# EAGLE design 2020can_master_v5 (EAGLE 9.6.2)
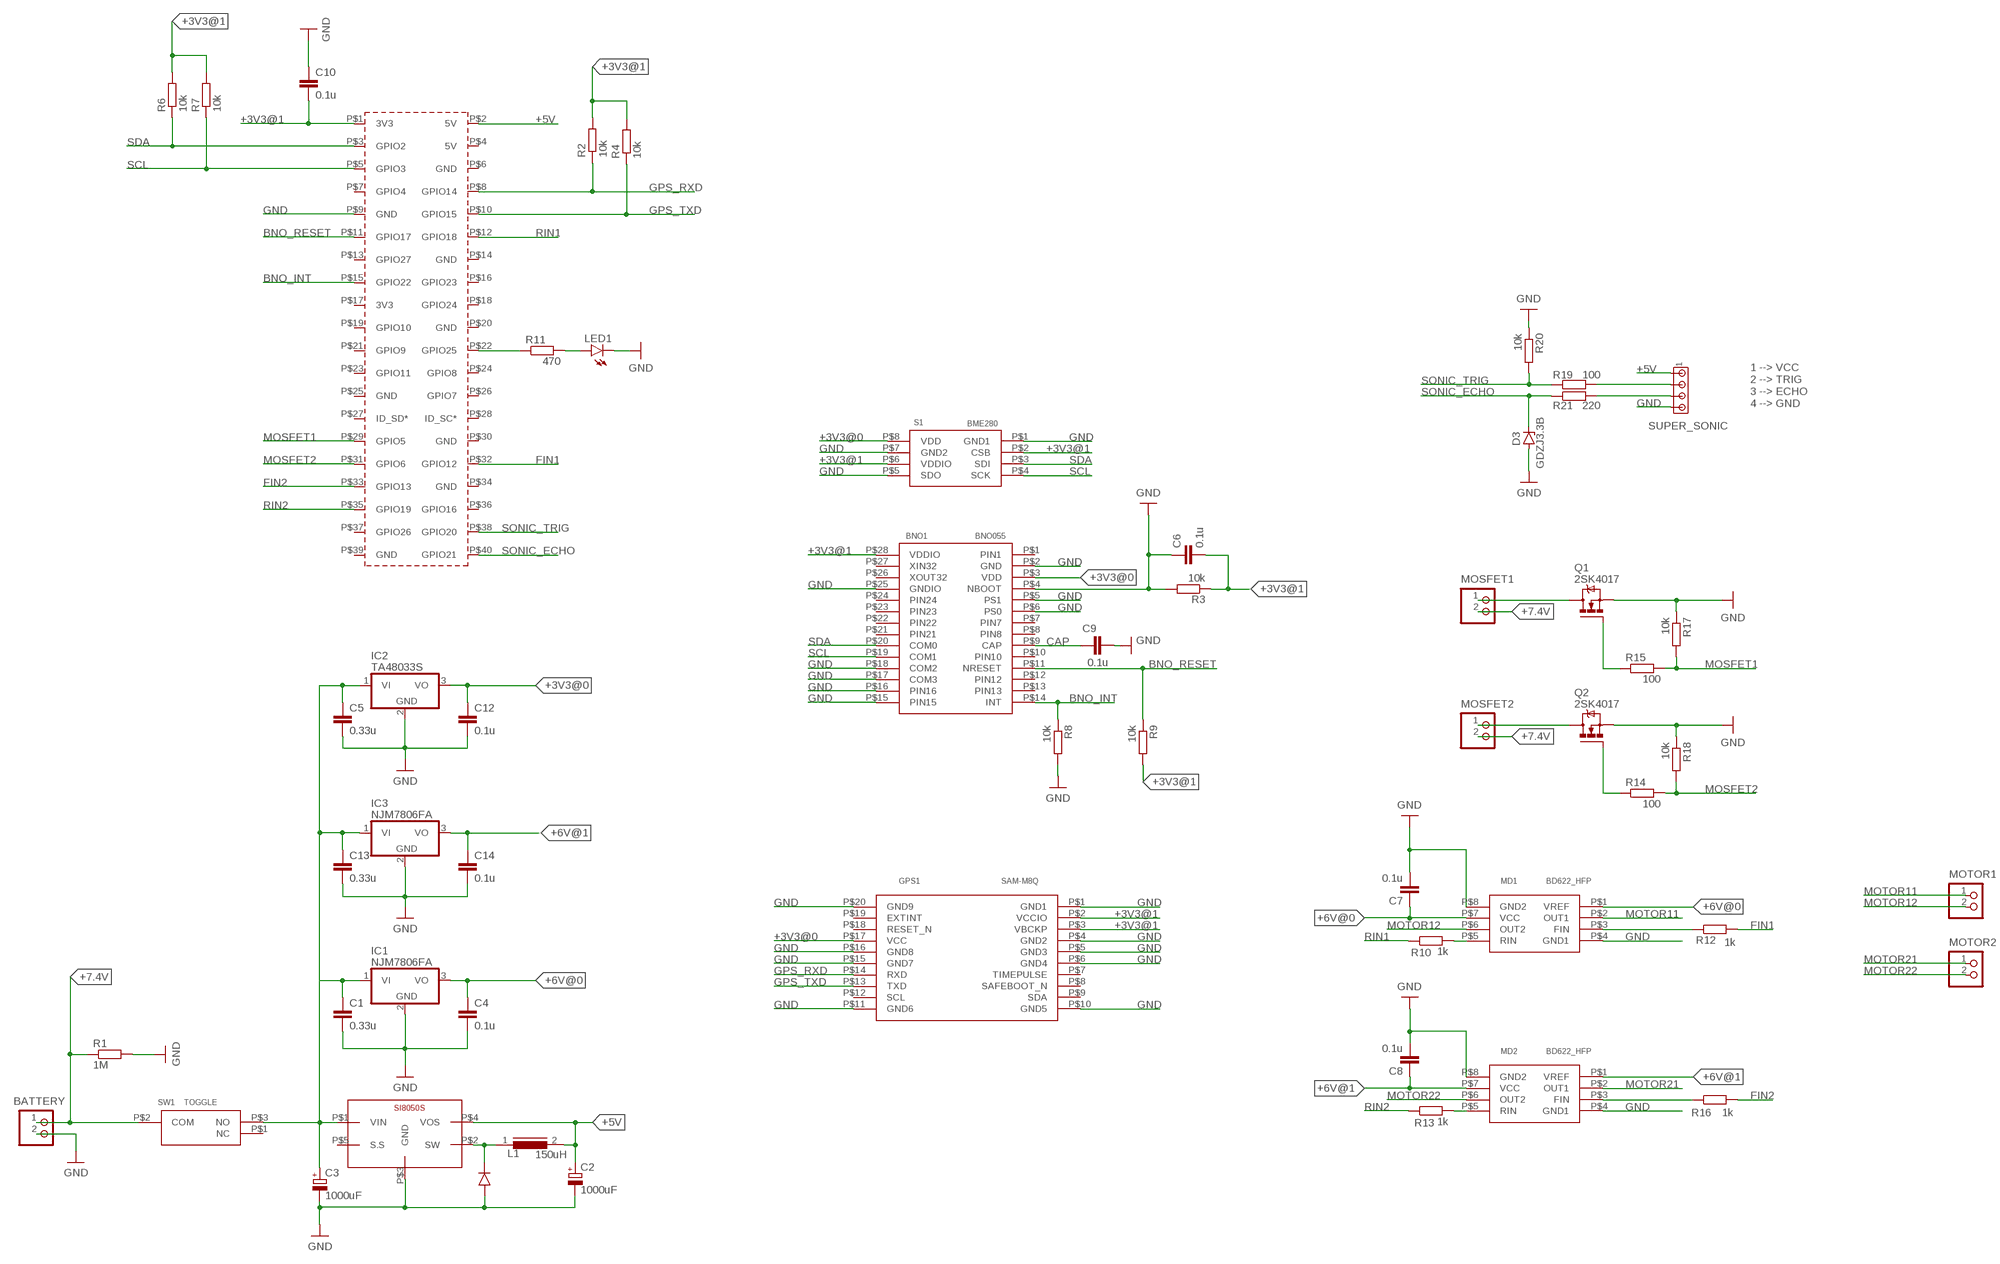
[diagram p0: schematic, sheet 1]

## Parts
BATTERY  B2P-VH  [B2P-VH]
BNO1  BNO055  [BNO055]
C1  0.33u  C5/3  [C5B3]
C2  1000uF  CPOL-EUE5-10.5  [E5-10,5]
C3  1000uF  CPOL-EUE5-10.5  [E5-10,5]
C4  0.1u  C5/3  [C5B3]
C5  0.33u  C5/3  [C5B3]
C6  0.1u  C-EUC1206  [C1206]
C7  0.1u  C-EUC1206  [C1206]
C8  0.1u  C-EUC1206  [C1206]
C9  0.1u  C-EUC1206  [C1206]
C10  0.1u  C-EUC1206  [C1206]
C12  0.1u  C5/3  [C5B3]
C13  0.33u  C5/3  [C5B3]
C14  0.1u  C5/3  [C5B3]
D3  GDZJ3.3B  1N821  [DO35Z10]
DIODE_1.1  DIODE_1.5  [DIODE_1.5]
GPS1  SAM-M8Q  [SAM-M8Q]
IC1  NJM7806FA  786TV  [TO220V]
IC2  TA48033S  786TV  [TO220V]
IC3  NJM7806FA  786TV  [TO220V]
L1  150uH  SFT830D  [SFT830D]
LED1  LED5MM  [LED5MM]
MD1  BD622_HFP  [BD62**_HRP7]
MD2  BD622_HFP  [BD62**_HRP7]
MOSFET1  B2P-VH  [B2P-VH]
MOSFET2  B2P-VH  [B2P-VH]
MOTOR1  B2P-VH  [B2P-VH]
MOTOR2  B2P-VH  [B2P-VH]
PCB1  RPI3RPI3  [RPI3]
Q1  2SK4017  IRF520  [TO220BV]
Q2  2SK4017  IRF520  [TO220BV]
R1  1M  R-EU_R2012  [R2012]
R2  10k  R-EU_R2012  [R2012]
R3  10k  R-EU_R2012  [R2012]
R4  10k  R-EU_R2012  [R2012]
R6  10k  R-EU_R2012  [R2012]
R7  10k  R-EU_R2012  [R2012]
R8  10k  R-EU_R2012  [R2012]
R9  10k  R-EU_R2012  [R2012]
R10  1k  R-EU_R2012  [R2012]
R11  470  R-EU_0207/10  [0207/10]
R12  1k  R-EU_R2012  [R2012]
R13  1k  R-EU_R2012  [R2012]
R14  100  R-EU_0207/10  [0207/10]
R15  100  R-EU_0207/10  [0207/10]
R16  1k  R-EU_R2012  [R2012]
R17  10k  R-EU_R2012  [R2012]
R18  10k  R-EU_R2012  [R2012]
R19  100  R-EU_0207/10  [0207/10]
R20  10k  R-EU_R2012  [R2012]
R21  220  R-EU_0207/10  [0207/10]
S1  BME280  [BME280]
SI8050S1  SI8050S  [SI8050S]
SUPER_SONIC  MTA04-100  [10X04MTA]
SW1  TOGGLE  TOGGLE_1MS1-T1-B1-M2-Q-N-S  [TOGGLE_1MS1-T1-B1-M2-Q-N-S]

## Nets
+3V3@0 [sensor]: BNO1.P$3(VDD) C12.1 GPS1.P$17(VCC) IC2.3(VO) S1.P$8(VDD)
+3V3@1 [sensor]: BNO1.P$28(VDDIO) C6.2 C10.2 GPS1.P$2(VCCIO) GPS1.P$3(VBCKP) PCB1.P$1(3V3) R2.2 R3.1 R4.2 R6.2 R7.2 R9.2 S1.P$2(CSB) S1.P$6(VDDIO)
+5V [power]: C2.+ L1.2 PCB1.P$2(5V) SI8050S1.P$4(VOS) SUPER_SONIC.1
+6V@0 [motor]: C4.1 C7.1 IC1.3(VO) MD1.P$1(VREF) MD1.P$7(VCC)
+6V@1 [motor]: C8.1 C14.1 IC3.3(VO) MD2.P$1(VREF) MD2.P$7(VCC)
+7.4V [power]: BATTERY.1 MOSFET1.2 MOSFET2.2 R1.1 SW1.P$2(COM)
BNO_INT [signal]: BNO1.P$14(INT) PCB1.P$15(GPIO22) R8.1
BNO_RESET [signal]: BNO1.P$11(NRESET) PCB1.P$11(GPIO17) R9.1
CAP [signal]: BNO1.P$9(CAP) C9.1
FIN1 [signal]: PCB1.P$32(GPIO12) R12.2
FIN2 [signal]: PCB1.P$33(GPIO13) R16.2
GND: BATTERY.2 BNO1.P$2(GND) BNO1.P$4(NBOOT) BNO1.P$5(PS1) BNO1.P$6(PS0) BNO1.P$15(PIN15) BNO1.P$16(PIN16) BNO1.P$17(COM3) BNO1.P$18(COM2) BNO1.P$25(GNDIO) C1.2 C2.- C3.- C4.2 C5.2 C6.1 C7.2 C8.2 C9.2 C10.1 C12.2 D3.A DIODE_1.1.P$1(ANODE) GPS1.P$1(GND1) GPS1.P$4(GND2) GPS1.P$5(GND3) GPS1.P$6(GND4) GPS1.P$10(GND5) GPS1.P$11(GND6) GPS1.P$15(GND7) GPS1.P$16(GND8) GPS1.P$20(GND9) IC1.2(GND) IC2.2(GND) LED1.K(C) MD1.P$4(GND1) MD1.P$8(GND2) MD2.P$4(GND1) MD2.P$8(GND2) PCB1.P$9(GND) Q1.S Q2.S R1.2 R3.2 R8.2 R17.1 R18.1 R20.1 S1.P$1(GND1) S1.P$5(SDO) S1.P$7(GND2) SI8050S1.P$3(GND) SUPER_SONIC.4
GPS_RXD [signal]: GPS1.P$14(RXD) PCB1.P$8(GPIO14) R2.1
GPS_TXD [signal]: GPS1.P$13(TXD) PCB1.P$10(GPIO15) R4.1
MOSFET1 [signal]: PCB1.P$29(GPIO5) R15.2 R17.2
MOSFET2 [signal]: PCB1.P$31(GPIO6) R14.2 R18.2
MOTOR11 [motor]: MD1.P$2(OUT1) MOTOR1.1
MOTOR12 [motor]: MD1.P$6(OUT2) MOTOR1.2
MOTOR21 [motor]: MD2.P$2(OUT1) MOTOR2.1
MOTOR22 [motor]: MD2.P$6(OUT2) MOTOR2.2
N$2 [motor]: DIODE_1.1.P$2(CATHODE) L1.1 SI8050S1.P$2(SW)
N$3 [signal]: PCB1.P$22(GPIO25) R11.1
N$4 [power]: C1.1 C3.+ C5.1 C13.1 IC1.1(VI) IC2.1(VI) IC3.1(VI) SI8050S1.P$1(VIN) SW1.P$3(NO)
N$5: LED1.A R11.2
N$6 [mos]: MOSFET1.1 Q1.D
N$7: MD1.P$3(FIN) R12.1
N$8 [mos]: MOSFET2.1 Q2.D
N$9: MD1.P$5(RIN) R10.2
N$10: Q1.G R15.1
N$11: Q2.G R14.1
N$12: MD2.P$3(FIN) R16.1
N$13: C13.2 C14.2 IC3.2(GND)
N$14: MD2.P$5(RIN) R13.2
N$15: R19.2 SUPER_SONIC.2
N$16: R21.2 SUPER_SONIC.3
RIN1 [signal]: PCB1.P$12(GPIO18) R10.1
RIN2 [signal]: PCB1.P$35(GPIO19) R13.1
SCL [signal]: BNO1.P$19(COM1) PCB1.P$5(GPIO3) R7.1 S1.P$4(SCK)
SDA [signal]: BNO1.P$20(COM0) PCB1.P$3(GPIO2) R6.1 S1.P$3(SDI)
SONIC_ECHO [signal]: D3.C PCB1.P$40(GPIO21) R21.1
SONIC_TRIG [signal]: PCB1.P$38(GPIO20) R19.1 R20.2
Unconnected: BNO1.P$1(PIN1) BNO1.P$7(PIN7) BNO1.P$8(PIN8) BNO1.P$10(PIN10) BNO1.P$12(PIN12) BNO1.P$13(PIN13) BNO1.P$21(PIN21) BNO1.P$22(PIN22) BNO1.P$23(PIN23) BNO1.P$24(PIN24) BNO1.P$26(XOUT32) BNO1.P$27(XIN32) GPS1.P$7(TIMEPULSE) GPS1.P$8(SAFEBOOT_N) GPS1.P$9(SDA) GPS1.P$12(SCL) GPS1.P$18(RESET_N) GPS1.P$19(EXTINT) PCB1.P$4(5V) PCB1.P$6(GND) PCB1.P$7(GPIO4) PCB1.P$13(GPIO27) PCB1.P$14(GND) PCB1.P$16(GPIO23) PCB1.P$17(3V3) PCB1.P$18(GPIO24) PCB1.P$19(GPIO10) PCB1.P$20(GND) PCB1.P$21(GPIO9) PCB1.P$23(GPIO11) PCB1.P$24(GPIO8) PCB1.P$25(GND) PCB1.P$26(GPIO7) PCB1.P$27(ID_SD*) PCB1.P$28(ID_SC*) PCB1.P$30(GND) PCB1.P$34(GND) PCB1.P$36(GPIO16) PCB1.P$37(GPIO26) PCB1.P$39(GND) SI8050S1.P$5(S.S) SW1.P$1(NC)

## Notes on the sheet
- 1 --> VCC
  2 --> TRIG
  3 --> ECHO
  4 --> GND

## Library data of the parts
BATTERY MOSFET1 MOSFET2 MOTOR1 MOTOR2 = CONN_VH:B2P-VH: Wire-to-Board 3.96mm pitch top mount connector Source: http://www.jst-mfg.com/product/pdf/jpn/VH.pdf http://www.jst-mfg.com/product/detail.php?series=262
BNO1 = BNO055:BNO055
C1 C4 C5 C12-C14 = capacitor-wima:C: CAPACITOR naming: grid - package width
C2 C3 = resistor:CPOL-EU: POLARIZED CAPACITOR, European symbol
C6-C10 = rcl:C-EU: CAPACITOR, European symbol; SPICEPREFIX: C
D3 = diode:1N821: Reference DIODE temperature compensated, 6,2 V
DIODE_1.1 = diode_1.5mm:DIODE_1.5
GPS1 = GPS:SAM-M8Q
IC1-IC3 = linear:78*: Positive VOLTAGE REGULATOR Source: http://cache.national.com/ds/LM/LM78L05.pdf http://www.fairchildsemi.com/ds/LM/LM7805.pdf
L1 = inductors:SFT830D: INDUCTOR; SPICEPREFIX: L
LED1 = led:LED: LED OSRAM: - CHIPLED LG R971, LG N971, LY N971, LG Q971, LY Q971, LO R971, LY R971 LH N974, LH R974 LS Q976, LO Q976, LY Q976 LO Q996 - Hyper CHIPLED LW Q18S LB Q993, LB Q99A, LB R99A - SideLED LS A670, LO A670, LY A670, LG A670, LP A670 LB A673, LV A673, LT A673, LW A673 LH A674 LY A675 LS A676, LA A676, LO A676, LY A676, LW A676 LS A679, LY A679, LG A679 - Hyper Micro SIDELED® LS Y876, LA Y876, LO Y876, LY Y876 LT Y87S - SmartLED LW L88C, LW L88S LB L89C, LB L89S, LG L890 LS L89K, LO L89K, LY L89K LS L896, LA L896, LO L896, LY L896 - TOPLED LS T670, LO T670, LY T670, LG T670, LP T670 LSG T670, LSP T670, LSY T670, LOP T670, LYG T670 LG T671, LOG T671, LSG T671 LB T673, LV T673, LT T673, LW T673 LH T674 LS T676, LA T676, LO T676, LY T676, LB T676, LH T676, LSB T676, LW T676 LB T67C, LV T67C, LT T67C, LS T67K, LO T67K, LY T67K, LW E67C LS E67B, LA E67B, LO E67B, LY E67B, LB E67C, LV E67C, LT E67C LW T67C LS T679, LY T679, LG T679 LS T770, LO T770, LY T770, LG T770, LP T770 LB T773, LV T773, LT T773, LW T773 LH T774 LS E675, LA E675, LY E675, LS T675 LS T776, LA T776, LO T776, LY T776, LB T776 LHGB T686 LT T68C, LB T68C - Hyper Mini TOPLED® LB M676 - Mini TOPLED Santana® LG M470 LS M47K, LO M47K, LY M47K Source: http://www.osram.convergy.de LUXEON: - LUMILED® LXK2-PW12-R00, LXK2-PW12-S00, LXK2-PW14-U00, LXK2-PW14-V00 LXK2-PM12-R00, LXK2-PM12-S00, LXK2-PM14-U00 LXK2-PE12-Q00, LXK2-PE12-R00, LXK2-PE12-S00, LXK2-PE14-T00, LXK2-PE14-U00 LXK2-PB12-K00, LXK2-PB12-L00, LXK2-PB12-M00, LXK2-PB14-N00, LXK2-PB14-P00, LXK2-PB14-Q00 LXK2-PR12-L00, LXK2-PR12-M00, LXK2-PR14-Q00, LXK2-PR14-R00 LXK2-PD12-Q00, LXK2-PD12-R00, LXK2-PD12-S00 LXK2-PH12-R00, LXK2-PH12-S00 LXK2-PL12-P00, LXK2-PL12-Q00, LXK2-PL12-R00 Source: www.luxeon.com KINGBRIGHT: KA-3528ASYC Source: www.kingbright.com
MD1 MD2 = BD62_:BD622*_HFP
PCB1 = Raspberry Pi 3 model B:RPI3: Device for Raspberry Pi 3 board created by Dave Young for www.element14.com More information and support community is available at https://www.element14.com/community/community/raspberry-pi Device for Raspberry Pi 3 board updated by Gerald Schwarz for www.element14.com On RPI3 addet the layer milling and created a mirrored shield.
Q1 Q2 = transistor-power:IRF520: HEXFET Power MOSFET
R1-R4 R6-R21 = rcl:R-EU_: RESISTOR, European symbol; SPICEPREFIX: R
S1 = BME280:BME280
SI8050S1 = SI-8050S:SI8050S
SUPER_SONIC = con-amp:MTA04-100: AMP connector
SW1 = switch:TOGGLE_1MS1-T1-B1-M2-Q-N-S

## Net classes
0 default: width 0.2 mm, clearance 0.05 mm
1 power: width 1.5 mm, clearance 0.2 mm
2 mos: width 1.5 mm, clearance 0.2 mm
3 signal: width 0.2 mm, clearance 0.05 mm
4 motor: width 0.8 mm, clearance 0.1 mm
5 sensor: width 0.3 mm, clearance 0.05 mm

## Board
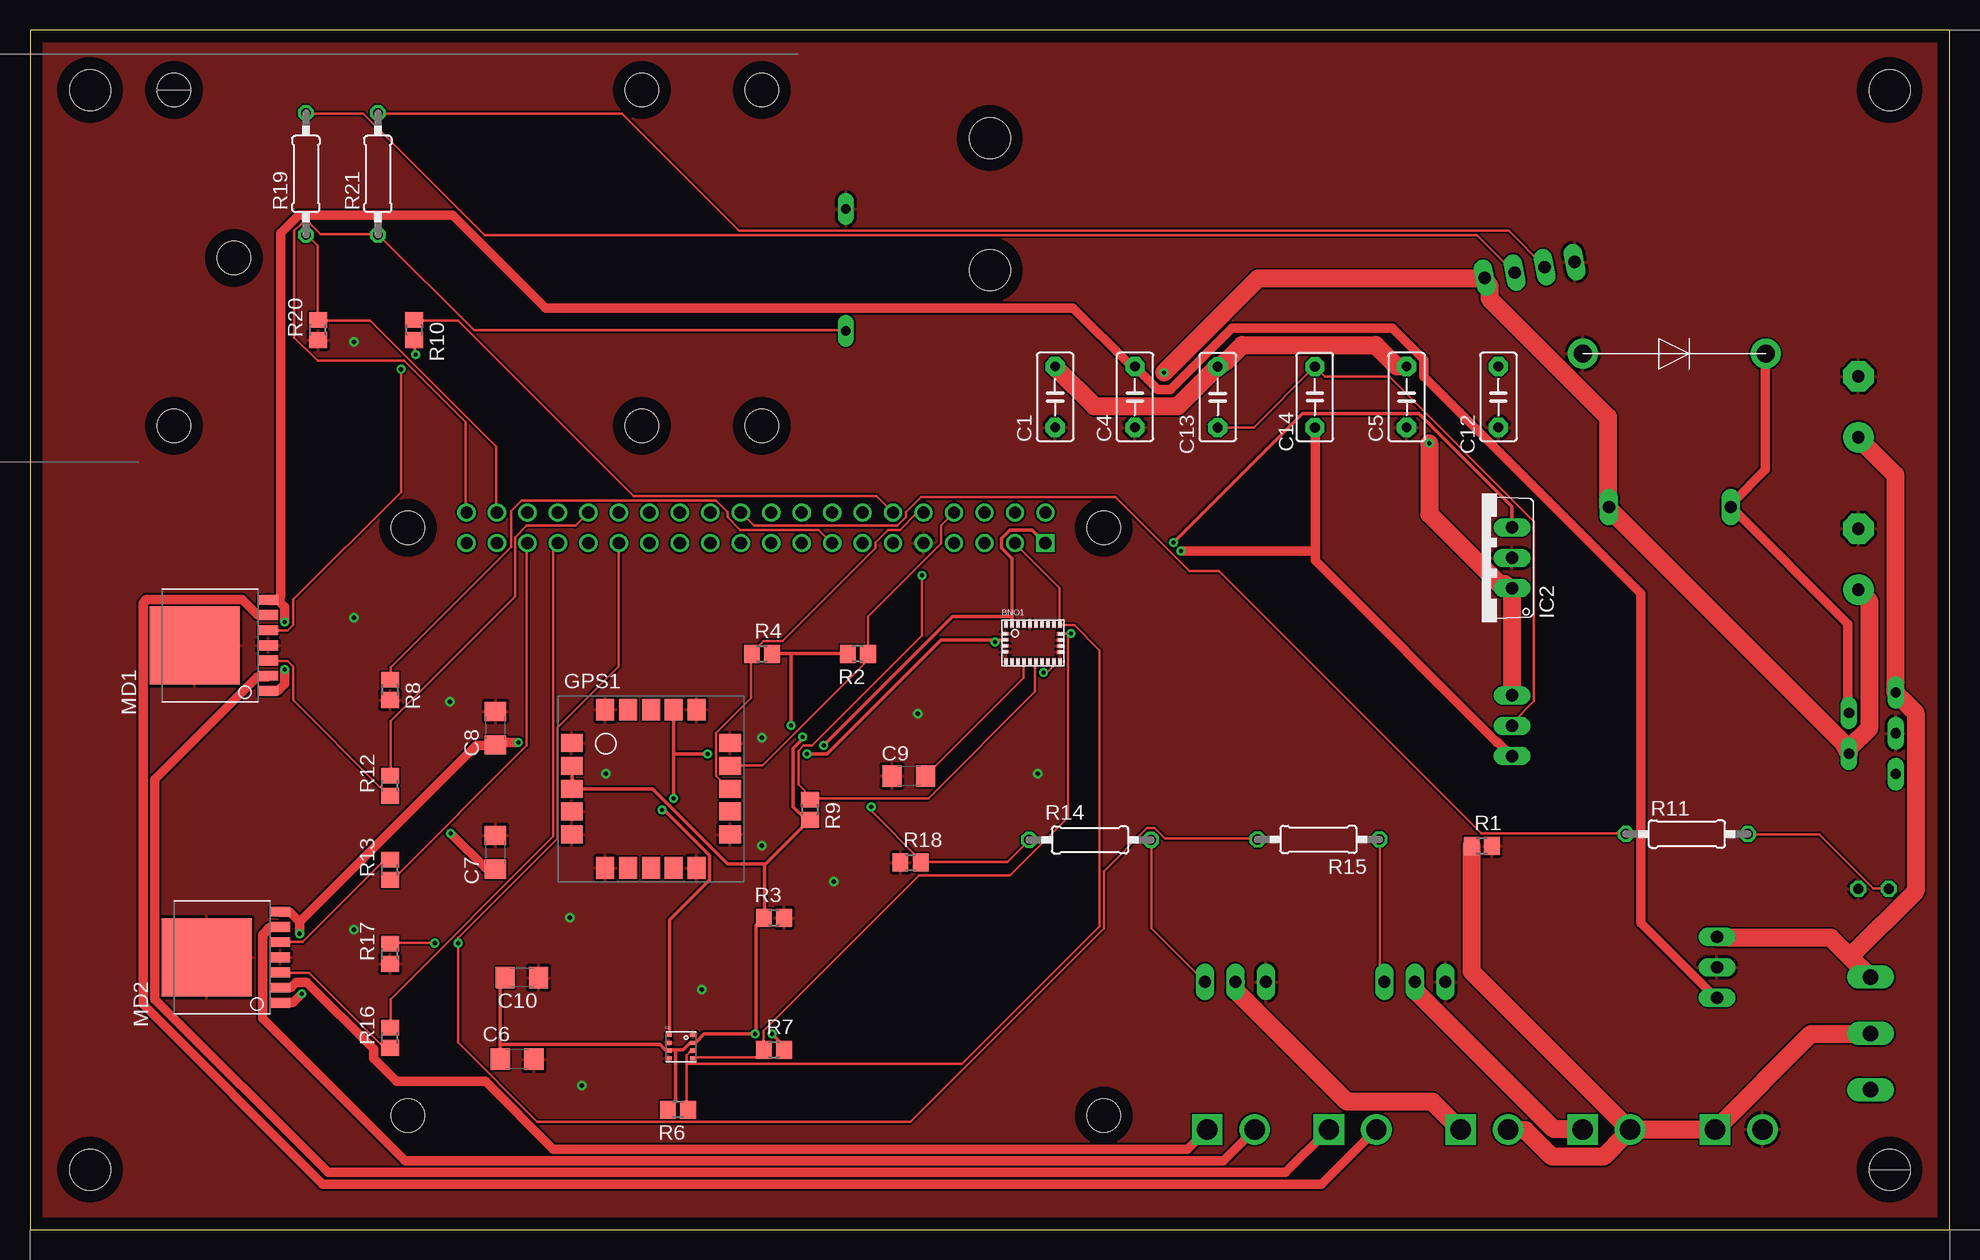
[diagram p1: board, top side]
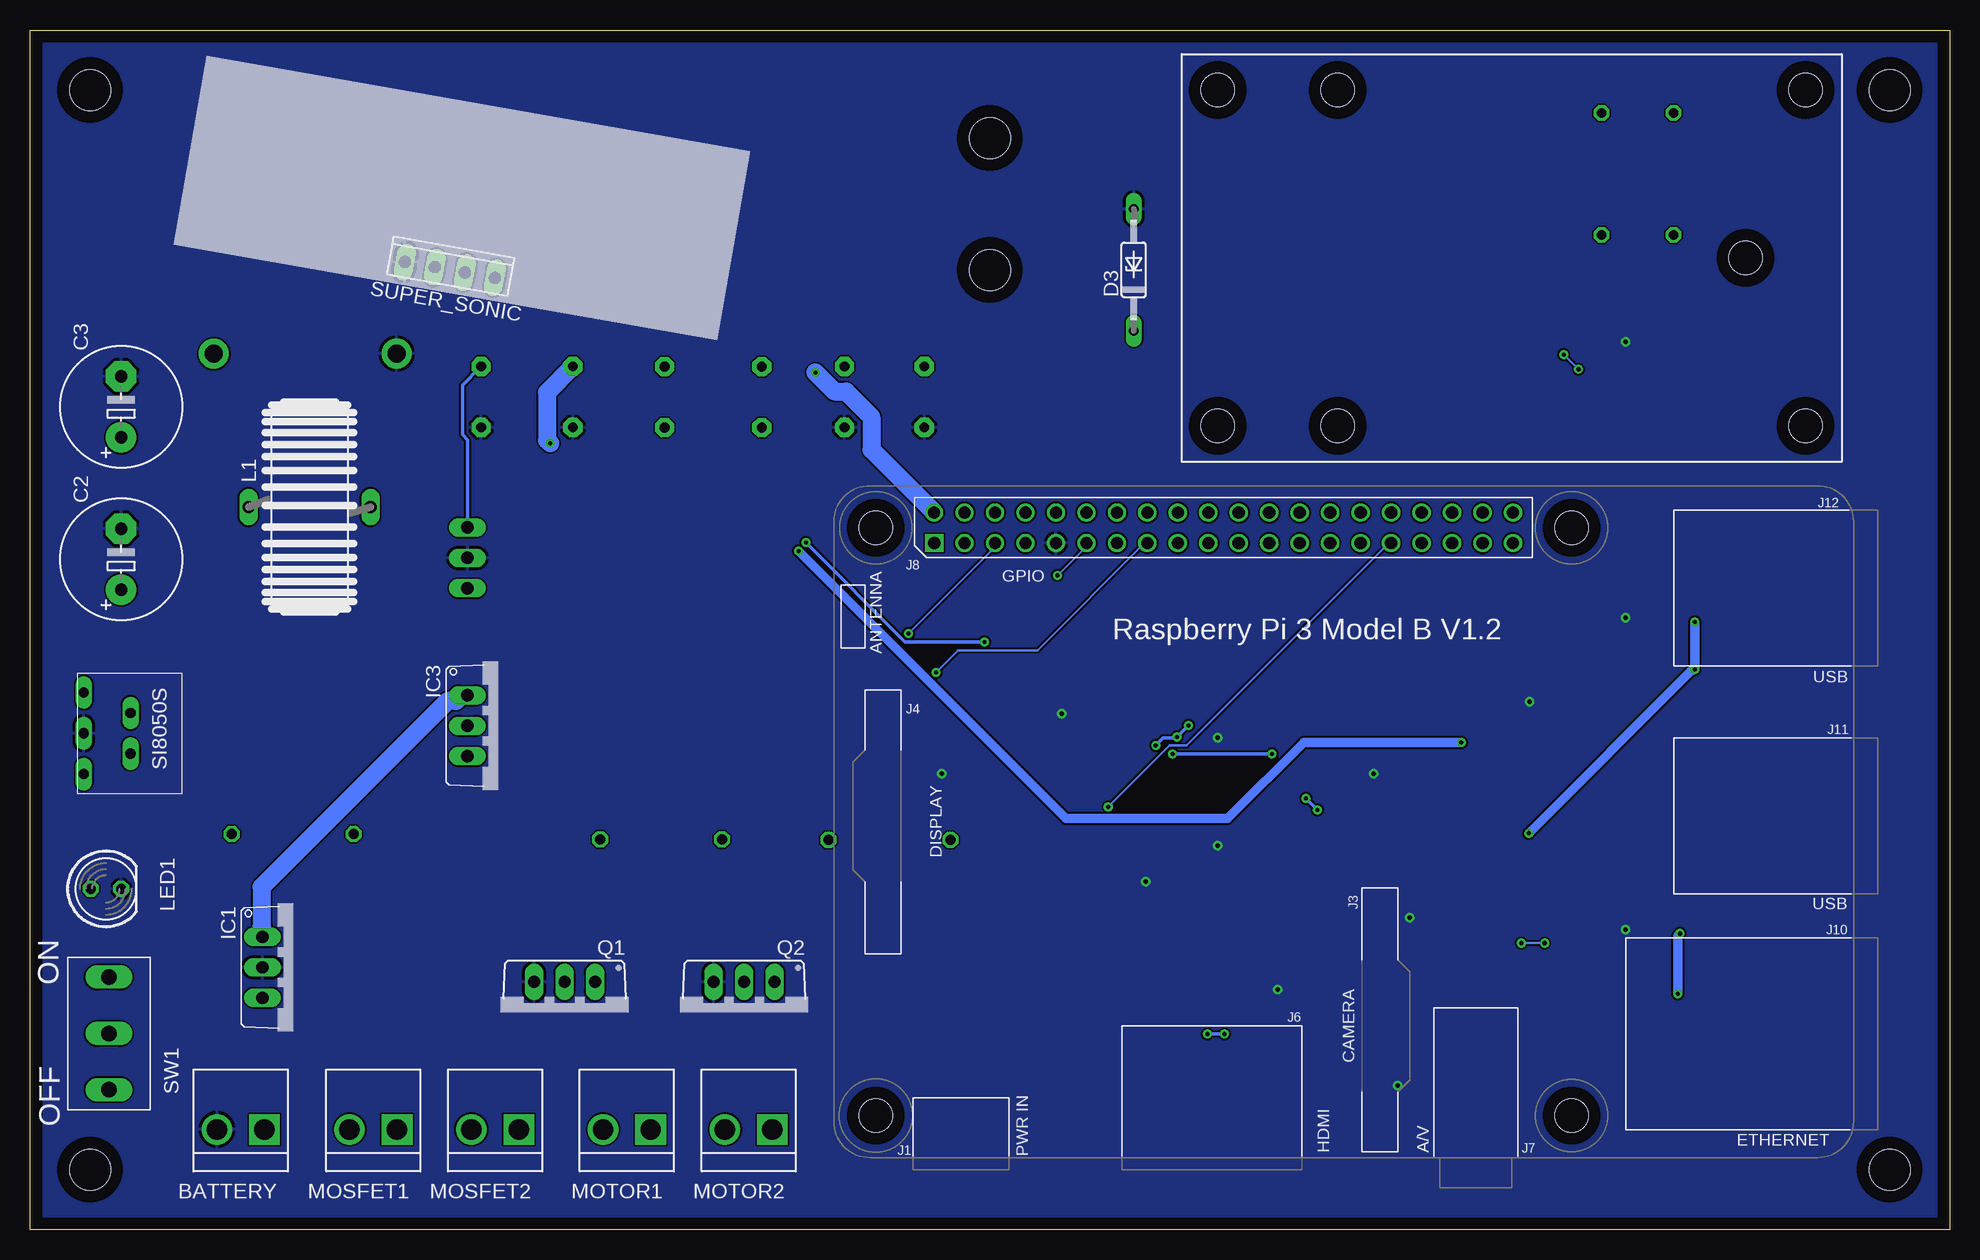
[diagram p2: board, bottom side, seen from below]

Size 160 x 100 mm. Coordinates in mm from the lower left corner, seen from the top.
Outline: 0,0 160,0 160,100 0,100 0,0
Copper layers (1*16): Top 0.035mm / dielectric 1.5mm / Bottom 0.035mm
Design rules "default": minimum track width 6mil, minimum drill 0.35mm, track to track 6mil, track to pad 6mil, pad to pad 6mil, via to via 6mil, smd to smd 6mil, copper to edge 40mil, drill to drill 6mil, minimum pad ring 10mil, minimum via ring 8mil, stop-mask expansion 4mil, vias tented up to drill 0mil, thermal gap 10mil
Holes 3.4 mm at 5,5 5,95 155,5 155,95 80,91 80,80
Holes 2.8 mm at 12,67 12,95 51,95 61,95 61,67 51,67 17,81

### Footprints (pad centres in the part's own frame; a part is rotated, then mirrored left to right if it is on the bottom)
B2P-VH = drill 1.7 square: 1 -1.98,0 | drill 1.7: 2 1.98,0
BNO055 = smd 0.305 x 0.61: P$1 0.35,3.47; P$6 0.355,0.35; P$7 0.855,0.35; P$8 1.355,0.35; P$9 1.855,0.35; P$10 2.355,0.35; P$11 2.855,0.35; P$12 3.355,0.35; P$13 3.855,0.35; P$14 4.355,0.35; P$15 4.855,0.35; P$20 4.85,3.47; P$21 4.35,3.47; P$22 3.85,3.47; P$23 3.35,3.47; P$24 2.85,3.47; P$25 2.35,3.47; P$26 1.85,3.47; P$27 1.35,3.47; P$28 0.85,3.47 | smd 0.61 x 0.305: P$2 0.275,2.655; P$3 0.275,2.155; P$4 0.275,1.655; P$5 0.275,1.155; P$16 4.915,1.15; P$17 4.915,1.65; P$18 4.915,2.15; P$19 4.915,2.65
C5B3 = drill 0.813 pad 1.6 octagon: 1 -2.54,0; 2 2.54,0
E5-10,5 = drill 1.016 pad 2.54: + -2.54,0 | drill 1.016 pad 2.54 octagon: - 2.54,0
C1206 = smd 1.6 x 1.8: 1 -1.4,0; 2 1.4,0
DO35Z10 = drill 0.813 long: A 5.08,0; C -5.08,0
DIODE_1.5 = drill 1.5 pad 2.5: P$1 -7.62,0; P$2 7.62,0
SAM-M8Q = smd 1.8 x 1.5: P$1 1.15,11.55; P$2 1.15,9.65; P$3 1.15,7.75; P$4 1.15,5.85; P$5 1.15,3.95; P$11 14.35,3.95; P$12 14.35,5.85; P$13 14.35,7.75; P$14 14.35,9.65; P$15 14.35,11.55 | smd 1.5 x 1.8: P$6 3.95,1.15; P$7 5.85,1.15; P$8 7.75,1.15; P$9 9.65,1.15; P$10 11.55,1.15; P$16 11.55,14.35; P$17 9.65,14.35; P$18 7.75,14.35; P$19 5.85,14.35; P$20 3.95,14.35
TO220V = drill 1.016 long: 1 -2.54,-2.54; 2 0,-2.54; 3 2.54,-2.54
SFT830D = drill 1.016 long: 1 -5.08,0; 2 5.08,0
LED5MM = drill 0.813 octagon: A -1.27,0; K 1.27,0
BD62**_HRP7 = smd 0.813 x 1.676: P$1 0.887,-0.835; P$2 2.158,-0.835; P$3 3.428,-0.835; P$4 4.697,-0.835; P$5 5.968,-0.835; P$6 7.237,-0.835; P$7 8.508,-0.835 | smd 6.5 x 7.49: P$8 4.7,5.272
RPI3 = drill 1.016 square: P$1 8.37,51.23 | drill 1.016: P$2 8.357,53.772; P$3 10.897,51.232; P$4 10.897,53.772; P$5 13.437,51.232; P$6 13.437,53.772; P$7 15.977,51.232; P$8 15.977,53.772; P$9 18.517,51.232; P$10 18.517,53.772; P$11 21.057,51.232; P$12 21.057,53.772; P$13 23.597,51.232; P$14 23.597,53.772; P$15 26.137,51.232; P$16 26.137,53.772; P$17 28.677,51.232; P$18 28.677,53.772; P$19 31.217,51.232; P$20 31.217,53.772; P$21 33.757,51.232; P$22 33.757,53.772; P$23 36.297,51.232; P$24 36.297,53.772; P$25 38.837,51.232; P$26 38.837,53.772; P$27 41.377,51.232; P$28 41.377,53.772; P$29 43.917,51.232; P$30 43.917,53.772; P$31 46.457,51.232; P$32 46.457,53.772; P$33 48.997,51.232; P$34 48.997,53.772; P$35 51.537,51.232; P$36 51.537,53.772; P$37 54.077,51.232; P$38 54.077,53.772; P$39 56.617,51.232; P$40 56.617,53.772 | hole 2.75: 3.5,3.5; 61.5,3.5; 3.5,52.5; 61.5,52.5
TO220BV = drill 1.016 long: D 0,-2.54; G -2.54,-2.54; S 2.54,-2.54
R2012 = smd 1.3 x 1.5: 1 -0.85,0; 2 0.85,0
0207/10 = drill 0.813 octagon: 1 -5.08,0; 2 5.08,0
BME280 = smd 0.5 x 0.35: P$1 2.275,2.225; P$2 2.275,1.575; P$3 2.275,0.925; P$4 2.275,0.275; P$5 0.225,0.275; P$6 0.225,0.925; P$7 0.225,1.575; P$8 0.225,2.225
SI8050S = drill 0.85 pad 0.9 long: P$1 -3.4,-8.2; P$2 -1.7,-4.3; P$3 0,-8.2; P$4 1.7,-4.3; P$5 3.4,-8.2
10X04MTA = drill 1.016 long: 1 3.81,0; 2 1.27,0; 3 -1.27,0; 4 -3.81,0
TOGGLE_1MS1-T1-B1-M2-Q-N-S = drill 1.3 long: P$1 1.65,3.43; P$2 6.35,3.43; P$3 11.05,3.43

### Placement (x,y rotation side)
BATTERY  142.43,8.35 180 bottom
BNO1  81,47 0 top
C1  85.45,69.41 270 top
C2  152.4,55.88 90 bottom
C3  152.4,68.58 90 bottom
C4  92.1,69.41 270 top
C5  114.75,69.41 270 top
C6  40.6,14.2 180 top
C7  38.8,31.45 90 top
C8  38.8,41.8 90 top
C9  73.25,37.8 180 top
C10  41,21 180 top
C12  122.4,69.41 270 top
C13  99,69.4 270 top
C14  107.1,69.4 90 top
D3  68,80 90 bottom
DIODE_1.1  137.05,73.01 0 top
GPS1  44,29 0 top
IC1  138.08,21.86 270 bottom
IC2  121,56 90 top
IC3  121,42 270 bottom
L1  136.7,60.23 0 bottom
LED1  153.67,28.4 0 bottom
MD1  19,44 90 top
MD2  20,18 90 top
MOSFET1  131.38,8.35 180 bottom
MOSFET2  121.22,8.35 180 bottom
MOTOR1  110.25,8.35 180 bottom
MOTOR2  100.09,8.35 180 bottom
PCB1  93,6 0 bottom
Q1  115.44,18.11 180 bottom
Q2  100.47,18.11 180 bottom
R1  121,32 0 top
R2  69,48 180 top
R3  62,26 0 top
R4  61,48 0 top
R6  54,10 180 top
R7  62,15 0 top
R8  30,45 270 top
R9  65,35 270 top
R10  32,75 270 top
R11  138.11,32.97 0 top
R12  30,37 90 top
R13  30,30 90 top
R14  88.36,32.48 180 top
R15  107.4,32.52 180 top
R16  30,16 90 top
R17  30,23 90 top
R18  73.4,30.6 0 top
R19  23,88 90 top
R20  24,75 90 top
R21  29,88 90 top
S1  53,14 0 top
SI8050S1  147.32,41.37 270 bottom
SUPER_SONIC  125,80 350 bottom
SW1  150,10 90 bottom

### Tracks (layer width: path | path; a pad name or v marks a point on that pad's centre or on a via)
+3V3@0  (via drill 0.35)
  Top 0.3: v52.68,34.98 52.86,34.98 56.65,31.19 56.65,29.16 53.3,25.81 53.3,16.3 S1.P$8 | 53.65,39.65 GPS1.P$17 | 53.65,39.65 v53.65,35.95 | 80.44,49.16 75.94,49.16 66.43,39.65 v64.75,39.65 | 80.44,49.16 81.23,49.16 BNO1.P$3 | 53.65,39.65 v56.47,39.65 | v95.32,57.27 106.07,68.01 115.76,68.01 123.52,60.26 123.52,58.59 IC2.3 | v80.44,48.98 80.44,49.16
  Bottom 0.3: IC2.3 123.52,58.59 123.52,65.81 123.96,66.25 123.96,70.39 122.46,71.89 C12.1 | v53.65,35.95 v52.68,34.98 | v56.47,39.65 v64.75,39.65 | v95.32,57.27 87.04,48.98 v80.44,48.98
+3V3@1  (via drill 0.35)
  Top 0.3: 39.2,15.42 39.2,20.61 39.56,20.97 C10.2 | 39.2,15.42 39.2,14.27 C6.2 | 53.83,14.98 54.45,14.98 54.97,15.51 55.24,15.51 S1.P$2 55.41,15.59 55.5,15.59 56.21,16.3 v60.44,16.3 60.52,16.39 60.52,25.37 61.05,25.9 R3.1 61.23,26.08 61.23,30.39 | 53.83,14.98 53.3,14.98 S1.P$6 53.12,14.98 52.95,14.98 52.51,15.42 39.2,15.42 | 53.83,14.98 53.83,10.66 53.21,10.04 R6.2 | v61.85,16.3 62.81,15.33 62.81,15.06 R7.2 | 81.84,51.1 81.84,55.94 80.96,56.83 80.96,57.62 81.67,58.32 83.52,58.32 84.58,57.27 PCB1.P$1 | 81.84,51.1 81.84,50.48 BNO1.P$28 | 63.43,48.01 68.1,48.01 R2.2 | 63.43,48.01 61.93,48.01 R4.2 | GPS1.P$2 45.2,38.59 45.2,36.83 GPS1.P$3 45.28,36.74 51.89,36.74 58.15,30.48 61.14,30.48 61.23,30.39 | 61.23,30.39 64.93,34.09 R9.2 64.75,34.09 63.61,35.24 63.61,40.09 64.4,40.88 v64.4,41.05 | v63.43,42.02 63.43,48.01 | 81.84,51.1 76.91,51.1 v66.16,40.35
  Bottom 0.3: v60.44,16.3 v61.85,16.3 | v63.43,42.02 v64.4,41.05 64.49,40.97 65.55,40.97 v66.16,40.35
+5V  (via drill 0.35)
  Top 1.5: C2.+ 152.41,53.3 153.29,52.42 153.29,41.76 151.62,40.09 151.62,39.73 SI8050S1.P$4 151.09,40.61 132.06,59.64 L1.2 131.53,60.26 131.53,67.75 121.67,77.62 121.67,78.67 SUPER_SONIC.1 121.23,79.29 102.37,79.29 v94.53,71.45
  Bottom 1.5: v94.53,71.45 92.94,69.86 91.98,69.86 89.86,67.75 89.86,65.02 84.66,59.82 PCB1.P$2
+6V@0  (via drill 0.35)
  Top 0.8: v21.23,46.69 21.23,45.46 20.7,44.93 19.91,44.93 MD1.P$1 | v21.23,50.66 21.23,51.89 20.7,52.42 | 20.7,52.42 19.91,52.42 MD1.P$7 | v35.06,33.04 37.97,30.13 38.76,30.13 C7.1 | IC1.3 140.61,19.38 140.43,19.38 134.26,25.55 134.26,53.04 116.2,71.1 116.2,72.51 113.56,75.15 100.17,75.15 95.06,70.04 94,70.04 92.15,71.89 C4.1 91.71,72.07 86.95,76.82 42.99,76.82 35.24,84.58 22.38,84.58 20.88,83.08 20.88,52.77 20.7,52.42
  Bottom 0.8: v21.23,50.66 v21.23,46.69 21.58,46.52 v35.06,33.04
+6V@1  (via drill 0.35)
  Top 0.8: v22.64,19.65 21.94,18.94 20.88,18.94 MD2.P$1 | 22.46,25.64 v22.46,24.67 | 22.46,25.64 21.67,26.43 20.88,26.43 MD2.P$7 | 22.46,25.64 37.18,40.35 38.76,40.35 C8.1 39.12,40.61 v40.7,40.61 | 107.13,56.56 107.13,66.78 C14.1 | 107.13,56.56 107.13,55.77 122.28,40.61 122.37,40.61 123.52,39.47 IC3.3 | 107.13,56.56 v95.94,56.56
  Bottom 0.8: v22.64,19.65 22.64,24.49 v22.46,24.67 | v40.7,40.61 53.83,40.61 60.17,34.27 73.65,34.27 v95.94,56.56
+7.4V
  Top 1.5: SW1.P$2 153.38,16.3 148.45,16.3 140.52,8.37 BATTERY.1 139.73,8.37 134.09,8.37 MOSFET1.2 | R1.1 120.17,31.98 120.17,21.5 133.29,8.37 MOSFET1.2 | MOSFET2.2 123.25,8.28 124.66,8.28 126.86,6.08 131.18,6.08 132.85,7.75 MOSFET1.2
BNO_INT  (via drill 0.35)
  Top 0.2: v84.49,46.43 84.75,46.43 85.28,46.96 85.28,47.31 BNO1.P$14 | R8.1 30.04,45.9 30.04,46.87 40.09,56.91 40.09,59.91 40.97,60.79 57.18,60.79 58.15,59.82 58.15,59.38 59.2,58.32 65.72,58.32 66.78,57.27 PCB1.P$15
  Bottom 0.2: v84.49,46.43 82.64,48.28 76.03,48.28 67.13,57.18 66.87,57.18 PCB1.P$15
BNO_RESET  (via drill 0.35)
  Top 0.2: BNO1.P$11 83.78,47.31 83.78,44.84 74.89,35.95 65.11,35.95 65.02,35.86 R9.1 65.11,36.03 64.05,37.09 64.05,39.91 64.49,40.35 65.19,40.35 74.36,49.51 v74.36,54.53
  Bottom 0.2: v74.36,54.53 71.98,56.91 71.98,57.18 PCB1.P$11
CAP
  Top 0.2: BNO1.P$9 82.81,47.31 82.81,45.99 74.71,37.88 C9.1
FIN1
  Top 0.2: R12.2 30.04,37.88 30.04,42.38 40.44,52.77 40.44,57.71 41.41,58.67 45.46,58.67 46.52,59.73 PCB1.P$32
FIN2
  Top 0.2: R16.2 30.04,16.91 30.04,19.21 43.61,32.77 43.61,56.83 43.96,57.18 PCB1.P$33
GND  (via drill 0.35)
  other vias: 27,51 27,74 35,44 48,38 45,26 46,12 67,29 74,43 61,32 61,41 56,20 27,25 84,38
  pour Bottom: 0,0 160,0 160,100 0,100
  pour Top: 0,0 160,0 160,100 0,100
GPS_RXD
  Top 0.2: PCB1.P$8 77,59.73 75.94,58.67 75.94,57.18 69.86,51.1 69.86,48.01 R2.1 69.78,47.93 69.78,47.4 61.05,38.68 58.41,38.68 GPS1.P$14
GPS_TXD
  Top 0.2: GPS1.P$13 58.32,36.83 58.15,36.83 57.18,37.8 57.18,41.41 60.08,44.31 60.08,47.93 R4.1 60.08,48.01 61.14,49.07 62.73,49.07 70.48,56.83 70.48,57.27 71.54,58.32 72.51,58.32 73.92,59.73 74.44,59.73 PCB1.P$10
MOSFET1  (via drill 0.35)
  Top 0.2: v33.74,23.88 30.04,23.88 R17.2 | PCB1.P$29 49.07,57.18 49.07,46.96 43.96,41.85 43.96,32.6 35.68,24.32 v35.68,23.88 35.68,15.59 42.29,8.99 73.39,8.99 89.51,25.11 89.51,29.87 93.12,33.48 93.74,33.48 94.62,32.6 102.28,32.6 R15.2
  Bottom 0.2: v35.68,23.88 v33.74,23.88
MOSFET2  (via drill 0.35)
  Top 0.2: R14.2 83.25,32.42 81.49,30.66 74.27,30.66 R18.2 74.27,30.75 70.13,34.89 v70.13,35.24
  Bottom 0.2: v70.13,35.24 65.02,40.35 63.61,40.35 46.78,57.18 46.6,57.18 PCB1.P$31
MOTOR11
  Top 0.8: MD1.P$2 19.82,46.08 18.94,46.08 10.4,37.53 10.4,19.21 24.84,4.76 104.66,4.76 108.19,8.28 MOTOR1.1
MOTOR12
  Top 0.8: MD1.P$6 19.82,51.27 18.94,51.27 17.71,52.51 9.69,52.51 9.43,52.24 9.43,18.77 24.4,3.79 107.66,3.79 112.15,8.28 MOTOR1.2
MOTOR21
  Top 0.8: MD2.P$2 20.88,20.18 21.76,20.18 22.2,20.61 23.08,20.61 28.63,15.06 28.63,14.27 30.57,12.33 37.97,12.33 43.61,6.7 96.47,6.7 98.06,8.28 MOTOR2.1
MOTOR22
  Top 0.8: MD2.P$6 20.79,25.2 20,25.2 19.38,24.58 19.38,17.62 31.28,5.73 99.47,5.73 102.02,8.28 MOTOR2.2
N$2
  Top 0.8: SI8050S1.P$2 151.53,43.08 151.53,50.48 141.84,60.17 L1.1 141.93,60.61 144.66,63.34 144.66,72.95 DIODE_1.1.P$2
N$3
  Top 0.2: R11.1 132.94,33.04 120.96,33.04 99.11,54.89 96.65,54.89 90.48,61.05 74.27,61.05 73.03,59.82 73.03,59.38 72.33,58.67 60.35,58.67 59.29,59.73 PCB1.P$22
N$4  (via drill 0.35)
  Top 1.5: 151.71,22.73 153.38,21.06 SW1.P$3 | 151.71,22.73 150.12,24.32 140.7,24.32 IC1.1 | C3.+ 152.41,65.99 155.5,62.9 155.5,44.84 SI8050S1.P$1 156.03,44.23 157.17,43.08 157.17,28.19 151.71,22.73 | IC3.1 123.52,44.58 123.52,53.39 IC2.1 122.9,53.83 122.46,53.83 116.64,59.64 v116.64,65.55 | C1.1 85.46,71.89 88.72,68.63 95.68,68.63 98.94,71.89 C13.1 99.64,72.33 101.05,73.74 112.15,73.74 113.91,71.98 114.71,71.98 C5.1
  Bottom 1.5: v116.64,65.55 116.91,65.81 116.91,69.78 114.79,71.89 C5.1 | IC1.1 140.61,24.4 140.61,25.11 140.7,25.2 140.7,28.54 125.19,44.05 124.48,44.05 124.05,44.49 123.6,44.49 IC3.1
N$5
  Top 0.2: LED1.A 154.88,28.46 153.65,28.46 149.15,32.95 143.25,32.95 R11.2
N$6
  Top 1.5: Q1.D 115.5,20.61 115.5,19.91 127.04,8.37 129.33,8.37 MOSFET1.1
N$7
  Top 0.2: R12.1 29.95,36.21 29.25,36.91 29.16,36.91 21.94,44.14 21.94,46.96 21.5,47.4 19.91,47.4 MD1.P$3
N$8
  Top 1.5: Q2.D 100.52,20.61 100.52,19.91 109.77,10.66 116.91,10.66 119.2,8.37 MOSFET2.1
N$9  (via drill 0.35)
  Top 0.2: v32.16,72.95 32.07,73.03 32.07,74.09 R10.2 | v30.92,71.71 30.92,61.49 21.94,52.51 21.94,50.39 21.5,49.95 19.91,49.95 MD1.P$5
  Bottom 0.2: v30.92,71.71 v32.16,72.95
N$10
  Top 0.2: R15.1 112.5,32.51 112.5,21.06 112.86,20.7 Q1.G
N$11
  Top 0.2: R14.1 93.47,32.42 93.47,25.11 97.88,20.7 Q2.G
N$12
  Top 0.2: R16.1 29.95,15.15 29.51,15.15 23.26,21.41 20.88,21.41 MD2.P$3
N$13
  Top 0.2: IC3.2 123.6,42.02 123.6,42.29 125.37,44.05 125.37,59.03 113.3,71.1 107.92,71.1 107.13,71.89 C14.2 107.04,71.89 102.02,66.87 99.02,66.87 C13.2
N$14
  Top 0.2: R13.2 29.95,30.84 29.6,30.84 22.73,23.96 20.88,23.96 MD2.P$5
N$15
  Top 0.2: R19.2 23.08,93.03 27.75,93.03 37.88,82.9 120.61,82.9 123.69,79.82 SUPER_SONIC.2
N$16
  Top 0.2: R21.2 29.07,93.03 49.34,93.03 59.12,83.25 123.25,83.25 126.25,80.26 SUPER_SONIC.3
RIN1
  Top 0.2: R10.1 32.07,75.77 35.68,75.77 50.3,61.14 70.57,61.14 71.89,59.82 PCB1.P$12
RIN2
  Top 0.2: R13.1 30.04,29.16 30.22,29.16 41.41,40.35 41.41,57.18 PCB1.P$35
SCL  (via drill 0.35)
  Top 0.2: S1.P$4 55.33,14.36 60.52,14.36 61.14,14.98 R7.1 61.14,15.06 61.14,16.56 74.09,29.51 81.67,29.51 86.51,34.36 86.51,49.6 v86.78,49.69 85.99,49.69 BNO1.P$19
  Bottom 0.2: v86.78,49.69 79.64,56.83 79.64,57.18 PCB1.P$5
SDA
  Top 0.2: 54.71,13.83 54.71,10.13 54.8,10.04 R6.1 | 54.71,13.83 54.71,14.54 55.06,14.89 55.24,14.89 S1.P$3 | PCB1.P$3 82.11,57.18 85.81,53.48 85.81,50.48 BNO1.P$20 85.9,50.39 87.04,50.39 89.16,48.28 89.16,25.29 77.7,13.83 54.71,13.83
SONIC_ECHO
  Top 0.2: PCB1.P$40 36.3,59.82 36.3,67.31 31.19,72.42 23.96,72.42 22.02,74.36 22.02,83.25 22.64,83.87 23.35,83.87 24.23,82.99 28.98,82.99 R21.1 29.07,82.9 37,74.97 67.92,74.97 D3.C
SONIC_TRIG
  Top 0.2: R19.1 23.08,82.9 23.96,82.02 23.96,75.85 R20.2 24.05,75.77 28.37,75.77 38.85,65.28 38.85,59.82 PCB1.P$38

### Text on the board
bPlace: ON | OFF
tDocu: FTE CanSat